# Altium project AD_STM32_.PrjPcb
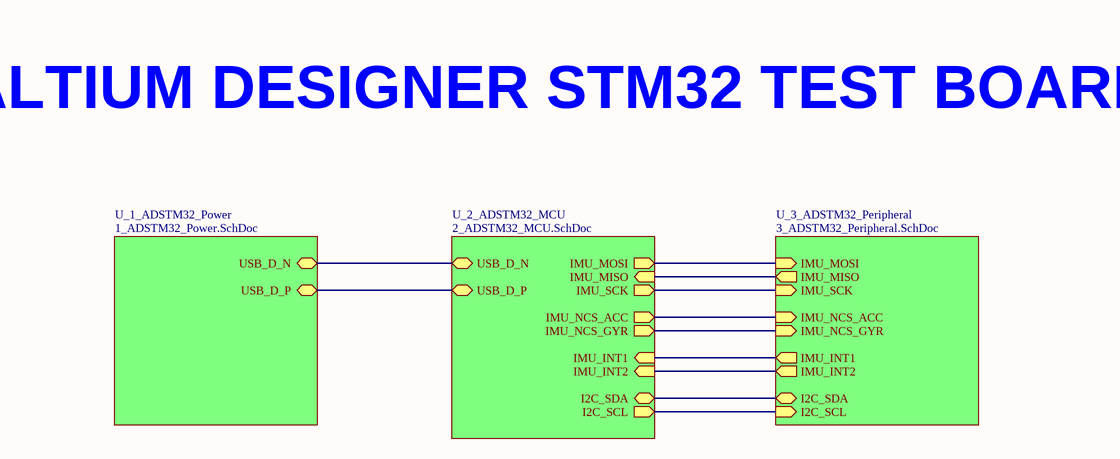
[diagram p0: 0_ADSTM32_Overview.SchDoc]
4 sheets, 39 parts. Net scope: hierarchical (ports join the sheet entries above them; power ports are global).
Board file: PCB1.PcbDoc
Sheets:
  0_ADSTM32_Overview.SchDoc
    U_1_ADSTM32_Power = 1_ADSTM32_Power.SchDoc
    U_2_ADSTM32_MCU = 2_ADSTM32_MCU.SchDoc
    U_3_ADSTM32_Peripheral = 3_ADSTM32_Peripheral.SchDoc

## Sheet 0_ADSTM32_Overview.SchDoc
size A; SheetNumber: 1; SheetTotal: 4

### Sub-sheets
U_1_ADSTM32_Power = 1_ADSTM32_Power.SchDoc: USB_D_N (bidir), USB_D_P (bidir)
U_2_ADSTM32_MCU = 2_ADSTM32_MCU.SchDoc: USB_D_N (bidir), USB_D_P (bidir), IMU_NCS_ACC (out), IMU_NCS_GYR (out), IMU_SCK (out), IMU_MOSI (out), IMU_MISO (in), I2C_SCL (out), I2C_SDA (bidir), IMU_INT1 (in), IMU_INT2 (in)
U_3_ADSTM32_Peripheral = 3_ADSTM32_Peripheral.SchDoc: IMU_SCK (in), IMU_MOSI (in), IMU_MISO (out), IMU_NCS_ACC (in), IMU_NCS_GYR (in), IMU_INT1 (out), IMU_INT2 (out), I2C_SCL (in), I2C_SDA (bidir)

### Nets
I2C_SCL: sheet U_2_ADSTM32_MCU/I2C_SCL, sheet U_3_ADSTM32_Peripheral/I2C_SCL
I2C_SDA: sheet U_2_ADSTM32_MCU/I2C_SDA, sheet U_3_ADSTM32_Peripheral/I2C_SDA
IMU_INT1: sheet U_2_ADSTM32_MCU/IMU_INT1, sheet U_3_ADSTM32_Peripheral/IMU_INT1
IMU_INT2: sheet U_2_ADSTM32_MCU/IMU_INT2, sheet U_3_ADSTM32_Peripheral/IMU_INT2
IMU_MISO: sheet U_2_ADSTM32_MCU/IMU_MISO, sheet U_3_ADSTM32_Peripheral/IMU_MISO
IMU_MOSI: sheet U_2_ADSTM32_MCU/IMU_MOSI, sheet U_3_ADSTM32_Peripheral/IMU_MOSI
IMU_NCS_ACC: sheet U_2_ADSTM32_MCU/IMU_NCS_ACC, sheet U_3_ADSTM32_Peripheral/IMU_NCS_ACC
IMU_NCS_GYR: sheet U_2_ADSTM32_MCU/IMU_NCS_GYR, sheet U_3_ADSTM32_Peripheral/IMU_NCS_GYR
IMU_SCK: sheet U_2_ADSTM32_MCU/IMU_SCK, sheet U_3_ADSTM32_Peripheral/IMU_SCK
USB_D_N: sheet U_1_ADSTM32_Power/USB_D_N, sheet U_2_ADSTM32_MCU/USB_D_N
USB_D_P: sheet U_1_ADSTM32_Power/USB_D_P, sheet U_2_ADSTM32_MCU/USB_D_P

### Notes on the sheet
- ALTIUM DESIGNER STM32 TEST BOARD

## Sheet 1_ADSTM32_Power.SchDoc
size A; SheetNumber: 2; SheetTotal: 4
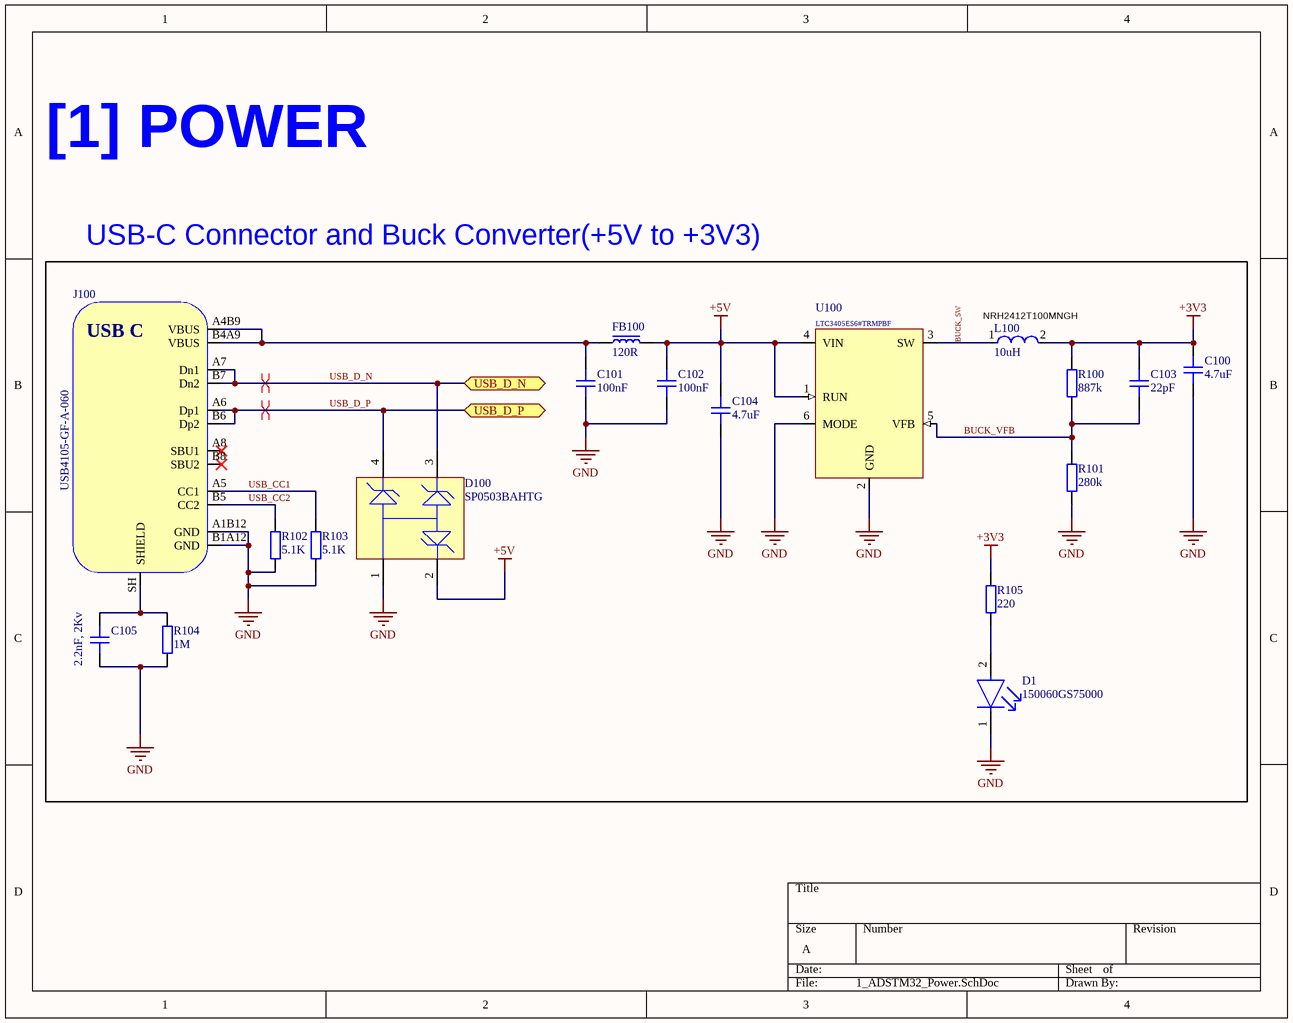
[diagram p1: 1_ADSTM32_Power.SchDoc]

### Parts
C100  4.7uF  [CAP_0603]
C101  100nF  [CAP_0603]
C102  100nF  [CAP_0603]
C103  22pF  [CAP_0603]
C104  4.7uF  [CAP_0603]
C105  2.2nF, 2Kv  [CAP_0603]
D1  150060GS75000  [FP-150060GS75000-MFG]
D100  SP0503BAHTG  [LFUS-SOT143-4_V]
FB100  120R  [FB_0603]
J100  USB4105-GF-A-060  [USB4105-GF-A-060]
L100  10uH  [FP-NRH2412-MFG]
R100  887k  [RES_0603]
R101  280k  [RES_0603]
R102  5.1K  [RES_0603]
R103  5.1K  [RES_0603]
R104  1M  [RES_0603]
R105  220  [RES_0603]
U100  LTC3405ES6#TRMPBF  [SOT-23-6]

### Blocks framed on the sheet
NRH2412T100MNGH: C100-C105 D1 D100 FB100 J100 L100 R100-R105 U100

### Ports
USB_D_N (bidir, see 0_ADSTM32_Overview[2B], 2_ADSTM32_MCU[1B]), USB_D_P (bidir, see 0_ADSTM32_Overview[2B], 2_ADSTM32_MCU[1B])

### Nets
+3V3: C100.2 C103.2 L100.2 R100.2 R105.2
+5V: C102.2 C104.2 D100.2 FB100.2 U100.1(RUN) U100.4(VIN)
GND: C100.1 C101.1 C102.1 C104.1 C105.2 D1.1(C) D100.1 J100.A1B12(GND) J100.B1A12(GND) R101.1 R102.2 R103.2 R104.2 U100.2(GND) U100.6(MODE)
BUCK_SW: L100.1 U100.3(SW)
BUCK_VFB: C103.1 R100.1 R101.2 U100.5(VFB)
USB_CC1: J100.A5(CC1) R103.1
USB_CC2: J100.B5(CC2) R102.1
USB_D_N: D100.3 J100.A7(Dn1) J100.B7(Dn2) ; port USB_D_N
USB_D_P: D100.4 J100.A6(Dp1) J100.B6(Dp2) ; port USB_D_P
NetC101_2: C101.2 FB100.1 J100.A4B9(VBUS) J100.B4A9(VBUS)
NetC105_1: C105.1 J100.SH(SHIELD) R104.1
NetD1_2: D1.2(A) R105.1

Not connected (* = marked no-connect by the designer): J100 A8(SBU1)* B8(SBU2)*

### Layout directives
differential pair; differential pair class USB_D: USB_D_N
differential pair; differential pair class USB: USB_D_P

### Notes on the sheet
- [1] POWER
- USB-C Connector and Buck Converter(+5V to +3V3)
- (in symbol USB4105-GF-A-060) USB C

### Library data of the parts
C100 C104 C105 = CAP_0805_16V: Capacitor SMD 0805 16V
C101-C103 = CAP_0603_16V: Capacitor SMD 0603 16V
D1 = CMP-1426-00002-2: LED GREEN CLEAR 0603 SMD; Viewing Angle: 140°; Forward Current: 30mA; Dominant Wavelength: 520nm; Luminous Intensity: 430mcd; Lens Size: 0.7mm; Forward Voltage: 3.2V; Test Current: 20mA; Lens Color: Colorless; Case Code (Imperial): 0603; Case/Package: 0603; Case Code (Metric): 1608; Length: 1.6mm; Lens Style: Clear; Height: 0.8mm; RoHS Compliant: Yes; Package Quantity: 1; Max Operating Temperature: 85°C; Mount: Surface Mount; Wavelength: 520nm; Width: 0.8mm; Lens Transparency: Clear; Packaging: Cut Tape; Color: Green; Lead Free: Lead Free; Min Operating Temperature: -40°C; Series: WL-SMCW
D100 = CMP-2000-05191-1: TVS Diode Array, 30 pF, 30 KV, -40 to 85 degC, 4-Pin SOT143, RoHS, Tape and Reel; Manufacturer: Littelfuse; Direction Type: Uni-Directional; Product Height (mm): 1.05mm; Leakage Current (Max): 0.1uA; Clamping Voltage (Max): 8V; Reverse Stand-off Voltage: 5.5(Min)V; Configuration: Triple; Working Voltage: 5.5V; Product Length (mm): 3.04mm; Working Voltage (Max): 5.5V(Min); Capacitance Value: 30pF; Rad Hardened: No; Number of Elements: 3; Product Depth (mm): 1.4mm; Operating Temperature Max Deg. C: 85C; Suppressor Type: TVS; Operating Temperature Min Deg. C: -40C; Operating Temp Range: -40Cto85C; Mounting: SurfaceMount; Package / Case: SOT-143; Datasheet Version: Dec-13; Package Type: SOT-143; Packaging: TapeandReel; Pin Count: 3+Tab; Operating Temperature Classification: Industrial; Datasheet URL: https://datasheet.ciiva.com/15143/getdatasheetpartid-116020-15143550.pdf; Manufacturer URL: http://www.littelfuse.com/; Leakage Current: 0.1uA; Mounting Style: SurfaceMount; Clamping Voltage: 8V; Polarity: Uni-Directional
FB100 = FB_0603: Ferrite Bead SMD 0603
J100 = USB4105-GF-A-060: USB Connector Type C SMT 12 Pin; Manufacturer: GCT; Manufacturer Part Number: USB4105-GF-A-060
L100 = CMP-14484-000582-1: NRH2412T100MNGH -Shielded Wirewound Inductor 10uH 20% 0.51A 0.72Ω SMD; DC Resistance (DCR): 600mR; Current Rating: 450mA; Saturation Current: 810mA; Core Material: Ferrite; Test Frequency: 100kHz; Self Resonant Frequency: 29MHz; Termination: SMD/SMT; Shielding: Shielded; Height - Seated (Max): 0.047inch; Case/Package: Nonstandard; Tolerance: 20%; Height: 1.2mm; Package Quantity: 2500; Mount: Surface Mount; Min Operating Temperature: -25°C; Inductance: 10uH; Width: 0.095inch; Length: 0.095inch; RoHS Compliant: Yes; Max DC Current: 810mA; Packaging: Tape and Reel; Max Operating Temperature: 120°C; Halogen Free: Halogen Free
R100-R103 R105 = RES_0603: Resistor SMD 0603; Manufacturer: *; Manufacturer Part Number: *; Distributor Link: *
R104 = RES_0805: Resistor SMD 0805; Manufacturer: *; Manufacturer Part Number: *; Distributor Link: *
U100 = LTC3405ES6#TRMPBF: 1.5MHz, 300mA / Synchronous Step-Down / Regulator in ThinSOT; Manufacturer: Analog Devices; Manufacturer Part Number: LTC3405ES6#TRMPBF

## Sheet 2_ADSTM32_MCU.SchDoc
size A; SheetNumber: 3; SheetTotal: 4
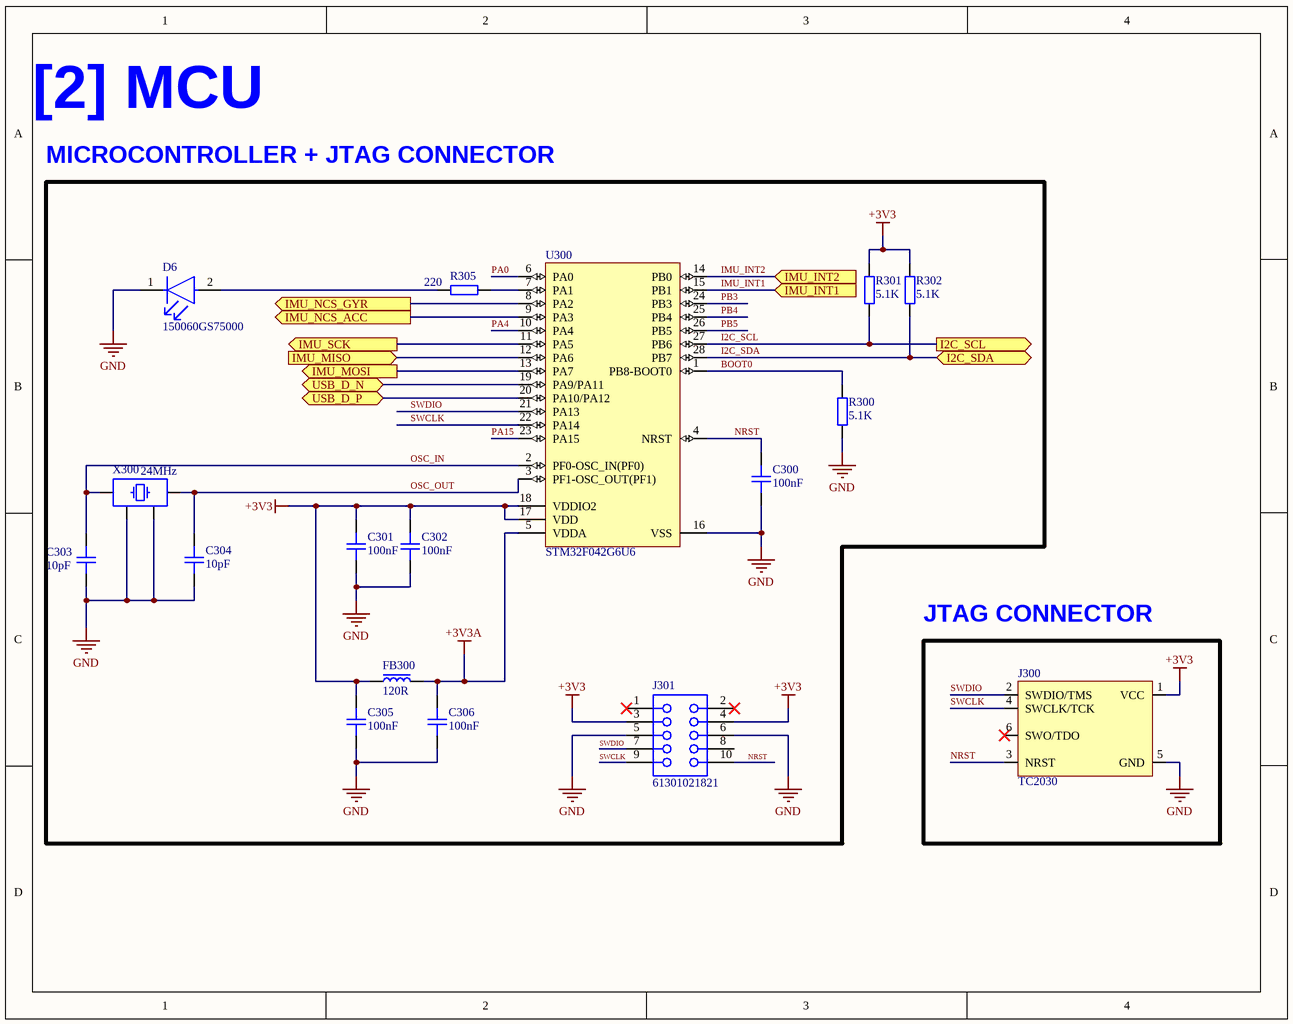
[diagram p2: 2_ADSTM32_MCU.SchDoc]

### Parts
C300  100nF  [CAP_0603]
C301  100nF  [CAP_0603]
C302  100nF  [CAP_0603]
C303  10pF  [CAP_0603]
C304  10pF  [CAP_0603]
C305  100nF  [CAP_0603]
C306  100nF  [CAP_0603]
D6  150060GS75000  [FP-150060GS75000-MFG]
FB300  120R  [FB_0603]
J300  TC2030  [TC2030-FP]  (no BOM)
J301  61301021821  [61301021821]
R300  5.1K  [RES_0603]
R301  5.1K  [RES_0603]
R302  5.1K  [RES_0603]
R305  220  [RES_0603]
U300  STM32F042G6U6  [STM-UFQFPN28_V]
X300  24MHz  [XTAL_3225]

### Ports
I2C_SCL (out, see 0_ADSTM32_Overview[3C], 3_ADSTM32_Peripheral[3B]), I2C_SDA (bidir, see 0_ADSTM32_Overview[3B], 3_ADSTM32_Peripheral[3B]), IMU_INT1 (in, see 0_ADSTM32_Overview[3B], 3_ADSTM32_Peripheral[3C]), IMU_INT2 (in, see 0_ADSTM32_Overview[3B], 3_ADSTM32_Peripheral[3C]), IMU_MISO (in, see 0_ADSTM32_Overview[3B], 3_ADSTM32_Peripheral[1C]), IMU_MOSI (out, see 0_ADSTM32_Overview[3B], 3_ADSTM32_Peripheral[1C]), IMU_NCS_ACC (out, see 0_ADSTM32_Overview[3B], 3_ADSTM32_Peripheral[1C]), IMU_NCS_GYR (out, see 0_ADSTM32_Overview[3B], 3_ADSTM32_Peripheral[1C]), IMU_SCK (out, see 0_ADSTM32_Overview[3B], 3_ADSTM32_Peripheral[1C]), USB_D_N (bidir, see 0_ADSTM32_Overview[2B], 1_ADSTM32_Power[2B]), USB_D_P (bidir, see 0_ADSTM32_Overview[2B], 1_ADSTM32_Power[2B])

### Nets
+3V3: C301.2 C302.2 C305.2 FB300.1 J300.1(VCC) J301.3 J301.4 R301.1 R302.1 U300.17(VDD) U300.18(VDDIO2)
+3V3A: C306.2 FB300.2 U300.5(VDDA)
GND: C300.1 C301.1 C302.1 C303.1 C304.1 C305.1 C306.1 D6.1(C) J300.5(GND) J301.5 J301.6 R300.2 U300.16(VSS) X300.2 X300.4
BOOT0: R300.1 U300.1(PB8-BOOT0)
I2C_SCL: R301.2 U300.27(PB6) ; port I2C_SCL
I2C_SDA: R302.2 U300.28(PB7) ; port I2C_SDA
IMU_INT1: U300.15(PB1) ; port IMU_INT1
IMU_INT2: U300.14(PB0) ; port IMU_INT2
IMU_MISO: U300.12(PA6) ; port IMU_MISO
IMU_MOSI: U300.13(PA7) ; port IMU_MOSI
IMU_NCS_ACC: U300.9(PA3) ; port IMU_NCS_ACC
IMU_NCS_GYR: U300.8(PA2) ; port IMU_NCS_GYR
IMU_SCK: U300.11(PA5) ; port IMU_SCK
NRST: C300.2 J300.3(NRST) J301.10 U300.4(NRST)
OSC_IN: C303.2 U300.2(PF0-OSC_IN(PF0)) X300.1
OSC_OUT: C304.2 U300.3(PF1-OSC_OUT(PF1)) X300.3
PA0: U300.6(PA0)
PA4: U300.10(PA4)
PA15: U300.23(PA15)
PB3: U300.24(PB3)
PB4: U300.25(PB4)
PB5: U300.26(PB5)
SWCLK: J300.4(SWCLK/TCK) J301.9 U300.22(PA14)
SWDIO: J300.2(SWDIO/TMS) J301.7 U300.21(PA13)
USB_D_N: U300.19(PA9/PA11) ; port USB_D_N
USB_D_P: U300.20(PA10/PA12) ; port USB_D_P
NetD6_2: D6.2(A) R305.2
NetR305_1: R305.1 U300.7(PA1)

Not connected (* = marked no-connect by the designer): J300 6(SWO/TDO)*; J301 1* 2* 8

### Notes on the sheet
- [2] MCU
- MICROCONTROLLER + JTAG CONNECTOR
- JTAG CONNECTOR

### Library data of the parts
C300-C306 = CAP_0603_16V: Capacitor SMD 0603 16V
D6 = CMP-1426-00002-2: as D1 on sheet 1_ADSTM32_Power; Case Code (Imperial): 0603; Case/Package: 0603; Case Code (Metric): 1608; Length: 1.6mm; Lens Style: Clear; Height: 0.8mm; RoHS Compliant: Yes; Package Quantity: 1; Max Operating Temperature: 85°C; Mount: Surface Mount; Wavelength: 520nm; Width: 0.8mm; Lens Transparency: Clear; Packaging: Cut Tape; Color: Green; Lead Free: Lead Free; Min Operating Temperature: -40°C; Series: WL-SMCW
FB300 = FB_0603: Ferrite Bead SMD 0603
J300 = TC2030: Tag-Connect No-Solder SWD Debug Connector DO NOT PLACE; Manufacturer: Tag-Connect; Manufacturer Part Number: TC2030
J301 = CMP-1502-01334-2: NexarPartId: 18818164; Contact Resistance: 20mΩ; Current Rating: 3A; Row Spacing: 2.54mm; Gender: Female; Number of Contacts: 10; Operating Supply Voltage: 250V; Insulation Resistance: 1GΩ; Connector Type: Header, Socket; Termination: Solder; Max Operating Temperature: 125°C; Number of Pins: 10; REACH SVHC: Unknown; Height: 8.6mm; Flammability Rating: UL94 V-0; Number of Rows: 2; Mount: Through Hole; Housing Material: PBT; RoHS: Compliant; Orientation: Vertical; Pitch: 2.54mm; Contact Plating: Gold; Voltage Rating: 250V; Color: Black; Width: 13.2mm; Length: 5.08mm; Min Operating Temperature: -40°C; Lead Pitch: 2.54mm; Number of Positions: 10; Contact Gender: Female; Contact Material: Copper
R300-R302 R305 = RES_0603: Resistor SMD 0603; Manufacturer: *; Manufacturer Part Number: *; Distributor Link: *
U300 = CMP-0304-00112-2: ARM Cortex-M0 32-bit MCU, 32 KB Flash, 6 KB Internal RAM, 24 I/Os, 28-Pin UFQFPN, -40 to 85 degC, Tray; Manufacturer: STMicroelectronics; FLASH Size (Prog) (kB): 32; I/Os (High Current): 24; Internal RAM Size (kB): 6; Supply Voltage(Vcc) min (V): 2; Operating Frequency(F) (Processor speed) (MHz): 48; Core: ARM Cortex-M0; PartNumber: STM32F042G6U6; Packing: Tray; Package Description: 28-Pin Ultra Thin Fine Pitch Quad Flat No-Lead, 4 x 4 x 0.6 mm Body, 0.5 mm Pitch; ComponentLink2Description: Datasheet; ComponentLink1Description: Manufacturer URL; Package Reference: UFQFPN28; DatasheetVersion: Rev. 5; ComponentLink1URL: http://www.st.com/; ComponentLink2URL: http://www.st.com/st-web-ui/static/active/en/resource/technical/document/datasheet/DM00105814.pdf; Mounting Technology: Surface Mount
X300 = TSX-3225_24.0000MF15X-AC: Crystal SMD 24MHz 10PPM 7pF 3225; Manufacturer: Epson; Manufacturer Part Number: TSX-3225 24.0000MF15X-AC

## Sheet 3_ADSTM32_Peripheral.SchDoc
size A; SheetNumber: 4; SheetTotal: 4
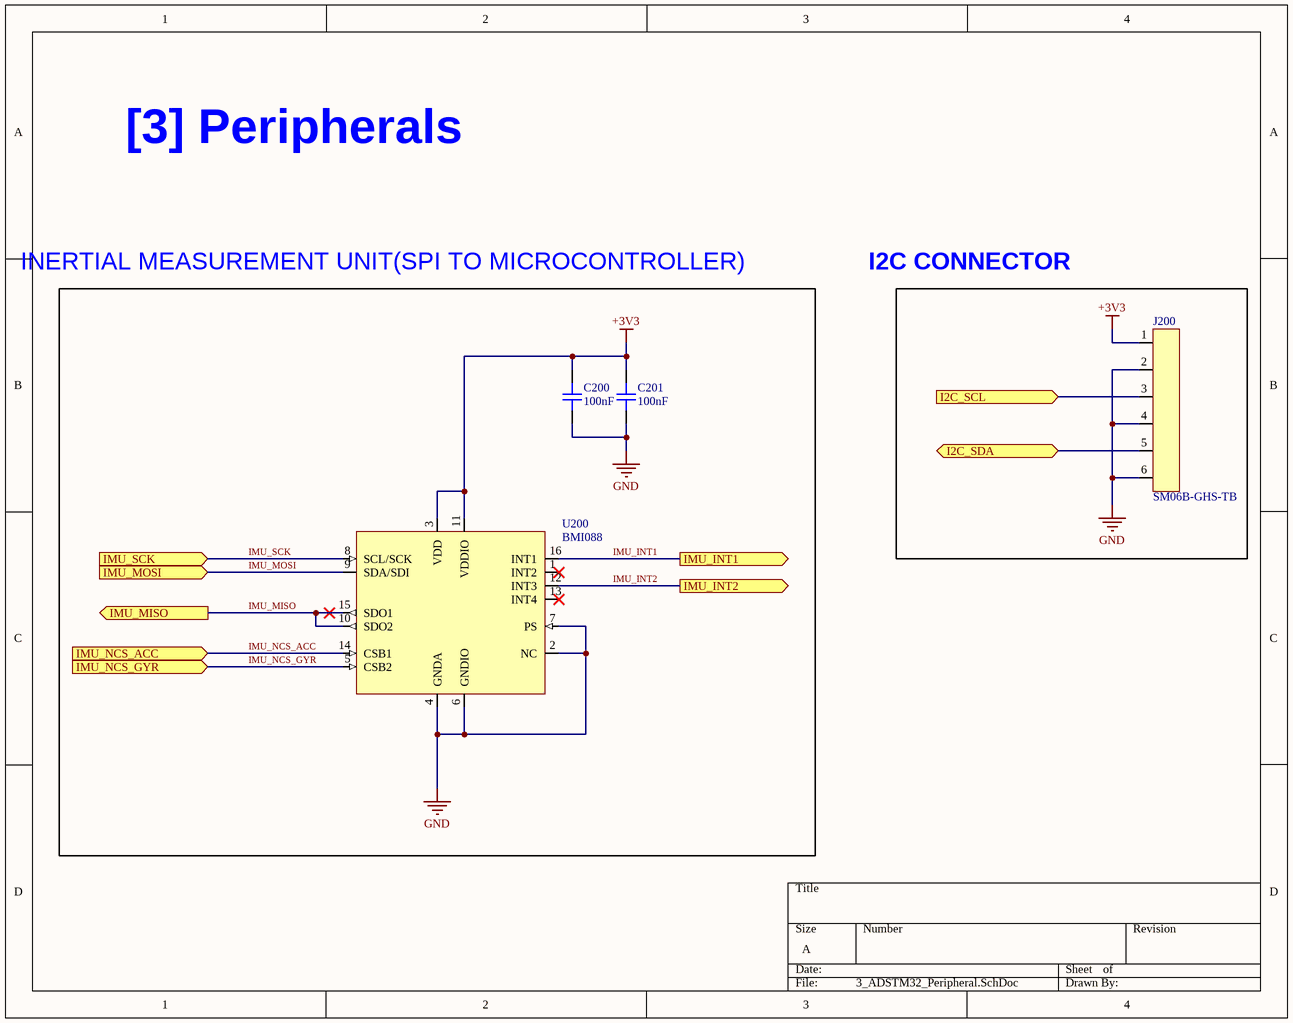
[diagram p3: 3_ADSTM32_Peripheral.SchDoc]

### Parts
C200  100nF  [CAP_0603]
C201  100nF  [CAP_0603]
J200  SM06B-GHS-TB  [SM06B-GHS-TB]
U200  BMI088  [BMI088]

### Ports
I2C_SCL (in, see 0_ADSTM32_Overview[3C], 2_ADSTM32_MCU[3A]), I2C_SDA (bidir, see 0_ADSTM32_Overview[3B], 2_ADSTM32_MCU[3B]), IMU_INT1 (out, see 0_ADSTM32_Overview[3B], 2_ADSTM32_MCU[3A]), IMU_INT2 (out, see 0_ADSTM32_Overview[3B], 2_ADSTM32_MCU[3A]), IMU_MISO (out, see 0_ADSTM32_Overview[3B], 2_ADSTM32_MCU[1B]), IMU_MOSI (in, see 0_ADSTM32_Overview[3B], 2_ADSTM32_MCU[1B]), IMU_NCS_ACC (in, see 0_ADSTM32_Overview[3B], 2_ADSTM32_MCU[1A]), IMU_NCS_GYR (in, see 0_ADSTM32_Overview[3B], 2_ADSTM32_MCU[1A]), IMU_SCK (in, see 0_ADSTM32_Overview[3B], 2_ADSTM32_MCU[1A])

### Nets
+3V3: C200.2 C201.2 J200.1 U200.3(VDD) U200.11(VDDIO)
GND: C200.1 C201.1 J200.2 J200.4 J200.6 U200.2(NC) U200.4(GNDA) U200.6(GNDIO) U200.7(PS)
I2C_SCL: J200.3 ; port I2C_SCL
I2C_SDA: J200.5 ; port I2C_SDA
IMU_INT1: U200.16(INT1) ; port IMU_INT1
IMU_INT2: U200.12(INT3) ; port IMU_INT2
IMU_MISO: U200.10(SDO2) U200.15(SDO1) ; port IMU_MISO
IMU_MOSI: U200.9(SDA/SDI) ; port IMU_MOSI
IMU_NCS_ACC: U200.14(CSB1) ; port IMU_NCS_ACC
IMU_NCS_GYR: U200.5(CSB2) ; port IMU_NCS_GYR
IMU_SCK: U200.8(SCL/SCK) ; port IMU_SCK

Not connected (* = marked no-connect by the designer): U200 1(INT2)* 13(INT4)*

### Notes on the sheet
- [3] Peripherals
- INERTIAL MEASUREMENT UNIT(SPI TO MICROCONTROLLER)
- I2C CONNECTOR

### Library data of the parts
C200 C201 = CAP_0603_16V: Capacitor SMD 0603 16V
J200 = SM06B-GHS-TB: Header Connector 6 Position 1.25MM Pitch SMD Horizontal JST GH; Manufacturer: JST; Manufacturer Part Number: SM06B-GHS-TB
U200 = BMI088: Inertial Measurement Unit IMU 6-Axis LGA; Manufacturer: Bosch; Manufacturer Part Number: BMI088

## Nets that join several sheets
+3V3: 1_ADSTM32_Power (5 pins), 2_ADSTM32_MCU (11 pins), 3_ADSTM32_Peripheral (5 pins)
GND: 1_ADSTM32_Power (15 pins), 2_ADSTM32_MCU (15 pins), 3_ADSTM32_Peripheral (9 pins)
I2C_SCL: 2_ADSTM32_MCU (R301.2 U300.27), 3_ADSTM32_Peripheral (J200.3)
I2C_SDA: 2_ADSTM32_MCU (R302.2 U300.28), 3_ADSTM32_Peripheral (J200.5)
IMU_INT1: 2_ADSTM32_MCU (U300.15), 3_ADSTM32_Peripheral (U200.16)
IMU_INT2: 2_ADSTM32_MCU (U300.14), 3_ADSTM32_Peripheral (U200.12)
IMU_MISO: 2_ADSTM32_MCU (U300.12), 3_ADSTM32_Peripheral (U200.10 U200.15)
IMU_MOSI: 2_ADSTM32_MCU (U300.13), 3_ADSTM32_Peripheral (U200.9)
IMU_NCS_ACC: 2_ADSTM32_MCU (U300.9), 3_ADSTM32_Peripheral (U200.14)
IMU_NCS_GYR: 2_ADSTM32_MCU (U300.8), 3_ADSTM32_Peripheral (U200.5)
IMU_SCK: 2_ADSTM32_MCU (U300.11), 3_ADSTM32_Peripheral (U200.8)
USB_D_N: 1_ADSTM32_Power (D100.3 J100.A7 J100.B7), 2_ADSTM32_MCU (U300.19)
USB_D_P: 1_ADSTM32_Power (D100.4 J100.A6 J100.B6), 2_ADSTM32_MCU (U300.20)